# EAGLE design 20x20_adapter_rush_v4_m2 (EAGLE 9.6.2)
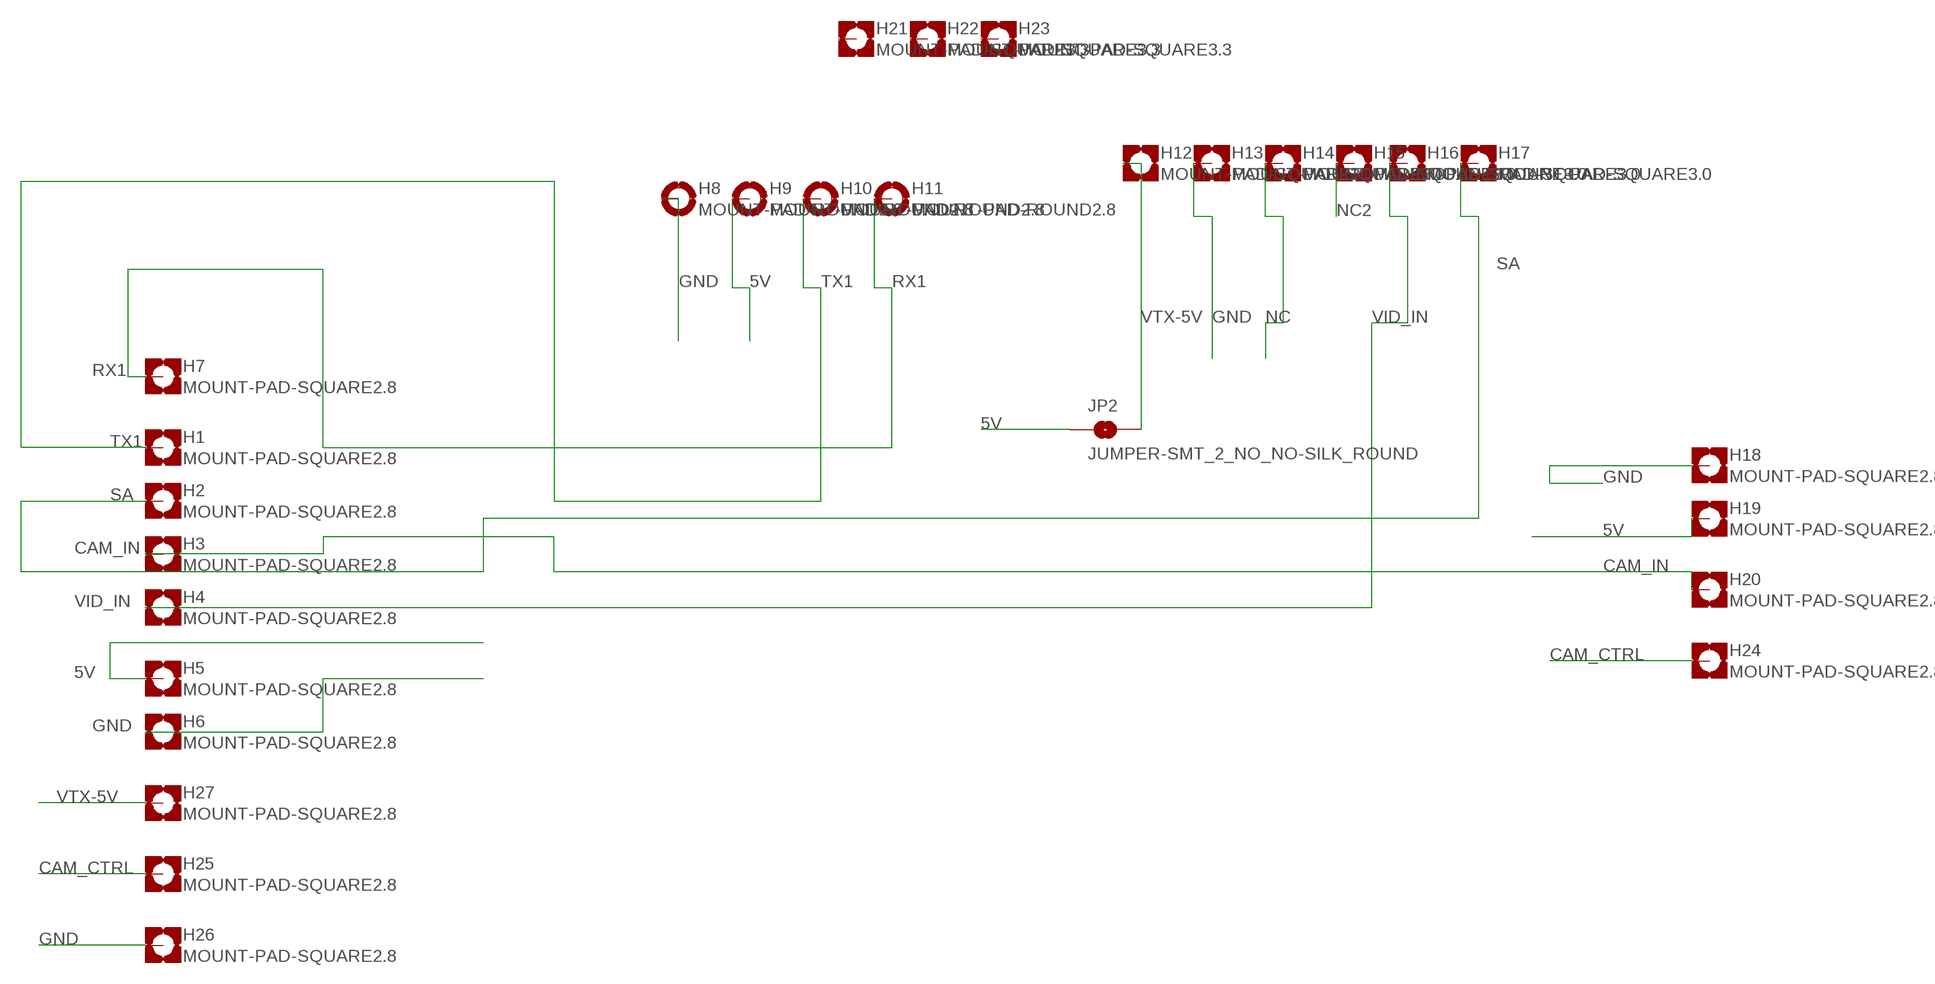
[diagram p0: schematic, sheet 1]

## Parts
H1  MOUNT-PAD-SQUARE2.8  [2,8-PAD-SQUARE]
H2  MOUNT-PAD-SQUARE2.8  [2,8-PAD-SQUARE]
H3  MOUNT-PAD-SQUARE2.8  [2,8-PAD-SQUARE]
H4  MOUNT-PAD-SQUARE2.8  [2,8-PAD-SQUARE]
H5  MOUNT-PAD-SQUARE2.8  [2,8-PAD-SQUARE]
H6  MOUNT-PAD-SQUARE2.8  [2,8-PAD-SQUARE]
H7  MOUNT-PAD-SQUARE2.8  [2,8-PAD-SQUARE]
H8  MOUNT-PAD-ROUND2.8  [1,0-PAD]
H9  MOUNT-PAD-ROUND2.8  [1,0-PAD]
H10  MOUNT-PAD-ROUND2.8  [1,0-PAD]
H11  MOUNT-PAD-ROUND2.8  [1,0-PAD]
H12  MOUNT-PAD-SQUARE3.0  [1,5-PAD-SQUARE]
H13  MOUNT-PAD-SQUARE3.0  [1,5-PAD-SQUARE]
H14  MOUNT-PAD-SQUARE3.0  [1,5-PAD-SQUARE]
H15  MOUNT-PAD-SQUARE3.0  [1,5-PAD-SQUARE]
H16  MOUNT-PAD-SQUARE3.0  [1,5-PAD-SQUARE]
H17  MOUNT-PAD-SQUARE3.0  [1,5-PAD-SQUARE]
H18  MOUNT-PAD-SQUARE2.8  [2,8-PAD-SQUARE]
H19  MOUNT-PAD-SQUARE2.8  [2,8-PAD-SQUARE]
H20  MOUNT-PAD-SQUARE2.8  [2,8-PAD-SQUARE]
H21  MOUNT-PAD-SQUARE3.3  [3,3-PAD-SQUARE]
H22  MOUNT-PAD-SQUARE3.3  [3,3-PAD-SQUARE]
H23  MOUNT-PAD-SQUARE3.3  [3,3-PAD-SQUARE]
H24  MOUNT-PAD-SQUARE2.8  [2,8-PAD-SQUARE]
H25  MOUNT-PAD-SQUARE2.8  [2,8-PAD-SQUARE]
H26  MOUNT-PAD-SQUARE2.8  [2,8-PAD-SQUARE]
H27  MOUNT-PAD-SQUARE2.8  [2,8-PAD-SQUARE]
JP2  JUMPER-SMT_2_NO_NO-SILK_ROUND  [SMT-JUMPER_2_NO_NO-SILK_ROUND]

## Nets
5V: H5.P$2(MOUNT) H9.B1,0(MOUNT) H19.P$2(MOUNT) JP2.1
CAM_CTRL: H24.P$2(MOUNT) H25.P$2(MOUNT)
CAM_IN: H3.P$2(MOUNT) H20.P$2(MOUNT)
GND: H6.P$2(MOUNT) H8.B1,0(MOUNT) H13.P$1(MOUNT) H18.P$2(MOUNT) H26.P$2(MOUNT)
NC: H14.P$1(MOUNT)
NC2: H15.P$1(MOUNT)
RX1: H7.P$2(MOUNT) H11.B1,0(MOUNT)
SA: H2.P$2(MOUNT) H17.P$1(MOUNT)
TX1: H1.P$2(MOUNT) H10.B1,0(MOUNT)
VID_IN: H4.P$2(MOUNT) H16.P$1(MOUNT)
VTX-5V: H12.P$1(MOUNT) H27.P$2(MOUNT) JP2.2
Unconnected: H21.P$1(MOUNT) H22.P$1(MOUNT) H23.P$1(MOUNT)

## Library data of the parts
H1-H7 H12-H27 = holes_custom:MOUNT-PAD-SQUARE: MOUNTING PAD, square
H8-H11 = holes_custom:MOUNT-PAD-ROUND: MOUNTING PAD, round
JP2 = SparkFun-Jumpers:JUMPER-SMT_2_NO: Normally open jumper This jumper has two pads in close proximity to each other. Apply solder to close the connection. Round pads are easier to solder for beginners, but are a lot larger. SparkFun Product that uses the round pads: SparkFun EL Sequencer <https://www.sparkfun.com/products/12781>

## Board
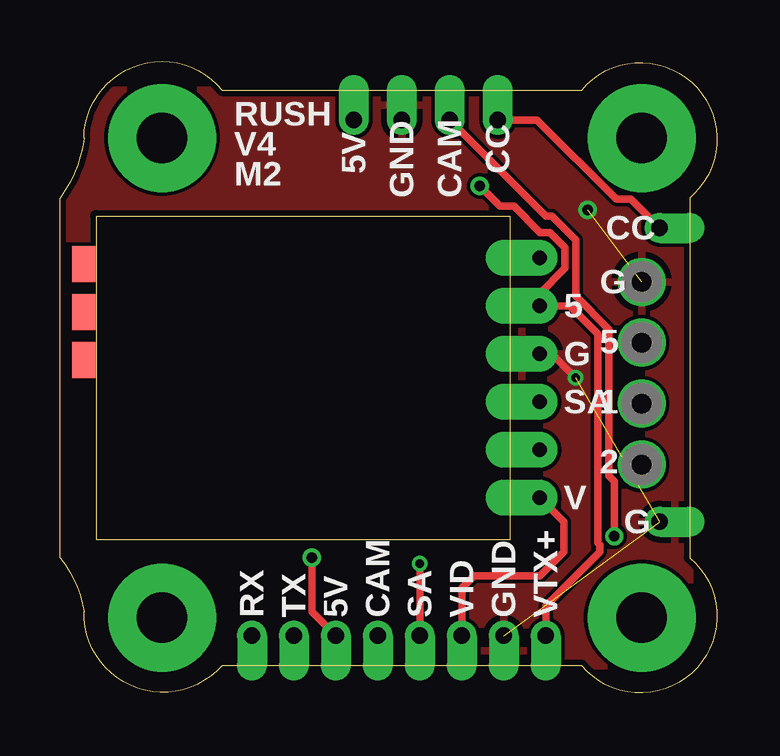
[diagram p1: board, top side]
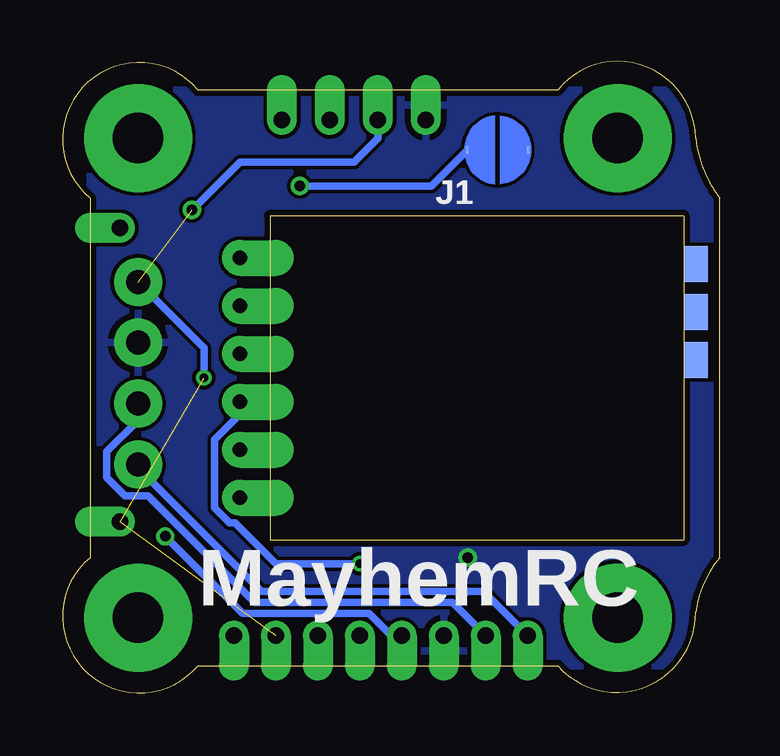
[diagram p2: board, bottom side, seen from below]

Size 27.39 x 26.33 mm. Coordinates in mm from the lower left corner, seen from the top.
Outline: 1.5,19.89 18.75,19.89 18.75,6.39 1.5,6.39 1.5,19.89
Outline: 6.75,25.14 21.75,25.14 arc-190 26.25,20.64 26.25,5.64 arc-190 21.75,1.14 6.75,1.14 arc-140 1,3.39 arc30 0,5.64 0,20.64 arc30 1,23.14 arc-140 6.75,25.14
Copper layers (1*16): Top 0.035mm / dielectric 1.5mm / Bottom 0.035mm
Design rules "SeeedStudio_2layer_DRU_no_angle_20140221": minimum track width 6mil, minimum drill 12mil, track to track 6mil, track to pad 6mil, pad to pad 6mil, via to via 6mil, smd to smd 0mil, copper to edge 10mil, drill to drill 10mil, minimum pad ring 10mil, minimum via ring 6mil, stop-mask expansion 2mil, vias tented up to drill 100mil, thermal gap 10mil
tRestrict: area 1.5,6.4 to 18.8,19.9

### Footprints (pad centres in the part's own frame; a part is rotated, then mirrored left to right if it is on the bottom)
2,8-PAD-SQUARE = drill 0.7 pad 1.25 offset: P$2 0.5,0
1,0-PAD = drill 1 pad 2: B1,0 0,0
1,5-PAD-SQUARE = drill 0.6 pad 1.5 offset: P$1 0,0
3,3-PAD-SQUARE = smd 1.5 x 1: P$1 0,0 | smd 1.5 x 1 bottom: P$2 0,0
SMT-JUMPER_2_NO_NO-SILK_ROUND = smd 0.152 x 0.305: 1 -1.27,0; 2 1.27,0

### Placement (x,y rotation side)
H1  9.75,1.89 90 top
H2  15,1.89 90 top
H3  13.25,1.89 90 top
H4  16.75,1.89 90 top
H5  12.25,24.39 270 bottom
H6  14.25,24.39 270 top
H7  8,1.89 90 top
H8  24.25,17.14 0 top
H9  24.25,14.6 90 top
H10  24.25,12.06 0 top
H11  24.25,9.52 0 top
H12  20,16.14 0 top
H13  20,14.14 0 top
H14  20,18.14 0 top
H15  20,10.14 0 top
H16  20,8.14 0 top
H17  20,12.14 0 top
H18  18.5,1.89 90 top
H19  11.5,1.89 90 top
H20  16.25,24.39 270 top
H21  1,17.89 90 top
H22  1,15.89 90 top
H23  1,13.89 90 top
H24  18.25,24.39 270 top
H25  25.5,19.39 180 top
H26  25.5,7.14 180 top
H27  20.25,1.89 90 top
JP2  9.25,22.64 180 bottom

### Tracks (layer width: path | path; a pad name or v marks a point on that pad's centre or on a via)
5V  (via drill 0.45)
  Top 0.305: H19.P$2 10.5,3.39 v10.5,5.64
  pour Bottom: 0,25.14 26.25,25.14 26.25,1.14 0,1.14
CAM_CTRL
  Top 0.305: H25.P$2 23.8,20.58 23.19,20.58 19.89,23.89 H24.P$2
CAM_IN  (via drill 0.45)
  Top 0.305: v23.11,6.53 23.11,8.82 22.88,9.04 22.88,15.15 21.5,16.54 21.5,17.5 21.51,17.51 21.51,18.88 20.5,19.89 20.25,19.89 H20.P$2
  Bottom 0.305: H3.P$2 13.69,2.39 14.62,3.32 19.89,3.32 v23.11,6.53
GND  (via drill 0.35, 0.45)  (3 unrouted)
  Top 0.305: H13.P$1 20.5,14.14 v21.5,13.14
  Bottom 0.305: v21.5,13.14 21.5,14.39 H8.B1,0 | H6.P$2 14.25,23.14 15.25,22.14 20,22.14 v22,20.14
  pour Top: 0,1.14 26.25,1.14 26.25,25.14 0,25.14
N$1  (via drill 2.1 pad 4.5)
  other vias: 4.25,3.14
N$2  (via drill 2.1 pad 4.5)
  other vias: 4.25,23.14
N$3  (via drill 2.1 pad 4.5)
  other vias: 24.25,3.14
N$4  (via drill 2.1 pad 4.5)
  other vias: 24.25,23.14
RX1
  Bottom 0.305: H11.B1,0 24.25,9.39 19.09,4.23 9.84,4.23 H7.P$2
SA  (via drill 0.35)
  Top 0.305: v15,5.39 H2.P$2
  Bottom 0.305: H17.P$1 20,11.63 21.05,10.58 21.05,7.7 20.44,7.08 20.2,7.08 18.5,5.39 v15,5.39
TX1
  Bottom 0.305: H10.B1,0 24.25,11.36 25.55,10.06 25.55,8.98 24.79,8.21 23.82,8.21 19.39,3.78 11.14,3.78 H1.P$2
VID_IN
  Top 0.305: H4.P$2 16.75,4.39 17.25,4.89 20,4.89 21,5.89 21,7.14 H16.P$1
VTX-5V  (via drill 0.45)
  Top 0.305: v17.5,21.14 18.34,20.3 18.92,20.3 20.02,19.19 20.44,19.19 21.05,18.58 21.05,17.7 20,16.65 H12.P$1 21.25,16.14 22.43,14.96 22.43,6.25 22.5,6.17 22.5,5.89 20.25,3.64 H27.P$2
  Bottom 0.305: v17.5,21.14 12.02,21.14 JP2.2

### Text on the board
tNames: RUSH | V4 | M2 | 5V | GND | CAM | CC | CC | G | 5 | 5 | G | SA | 1 | 2 | V | G | RX | TX | 5V | CAM | SA | VID | GND | VTX+
bNames: J1 | MayhemRC